# Altium schematic sheet RightInterface.SchDoc
size A4
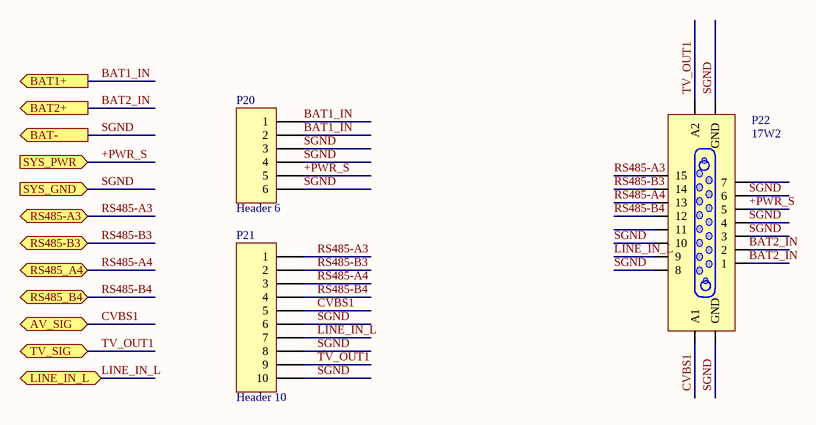
[diagram p0: RightInterface.SchDoc]

## Parts
P20  Header 6  [DS1X6-2.54]
P21  Header 10  [DS1X10-2.54]
P22  17W2  [17W2_FEMALE]

## Ports
AV_SIG (bidir), BAT1+ (out), BAT2+ (out), BAT- (out), LINE_IN_L (bidir), RS485-A3 (bidir), RS485-B3 (bidir), RS485_A4 (bidir), RS485_B4 (bidir), SYS_GND (in), SYS_PWR (in), TV_SIG (bidir)

## Nets
+PWR_S: P20.5 P22.5 ; port SYS_PWR
BAT1_IN: P20.1 P20.2 ; port BAT1+
BAT2_IN: P22.1 P22.2 ; port BAT2+
CVBS1: P21.5 P22.16(A1) ; port AV_SIG
LINE_IN_L: P21.7 P22.9 ; port LINE_IN_L
RS485-A3: P21.1 P22.15 ; port RS485-A3
RS485-A4: P21.3 P22.13 ; port RS485_A4
RS485-B3: P21.2 P22.14 ; port RS485-B3
RS485-B4: P21.4 P22.12 ; port RS485_B4
SGND: P20.3 P20.4 P20.6 P21.6 P21.8 P21.10 P22.3 P22.4 P22.6 P22.8 P22.10 P22.17(GND) P22.19(GND) ; port BAT-, port SYS_GND
TV_OUT1: P21.9 P22.18(A2) ; port TV_SIG

Not connected (* = marked no-connect by the designer): P22 7 11

## Library data of the parts
P20 = Header 6: Header, 6-Pin; LatestRevisionDate: 17-Jul-2002; LatestRevisionNote: Re-released for DXP Platform.; Publisher: Altium Limited
P21 = Header 10: Header, 10-Pin; LatestRevisionDate: 17-Jul-2002; LatestRevisionNote: Re-released for DXP Platform.; Publisher: Altium Limited
P22 = 17W2: Connector